# Altium schematic sheet 1_V5.schdoc
size 175 x 99 mm
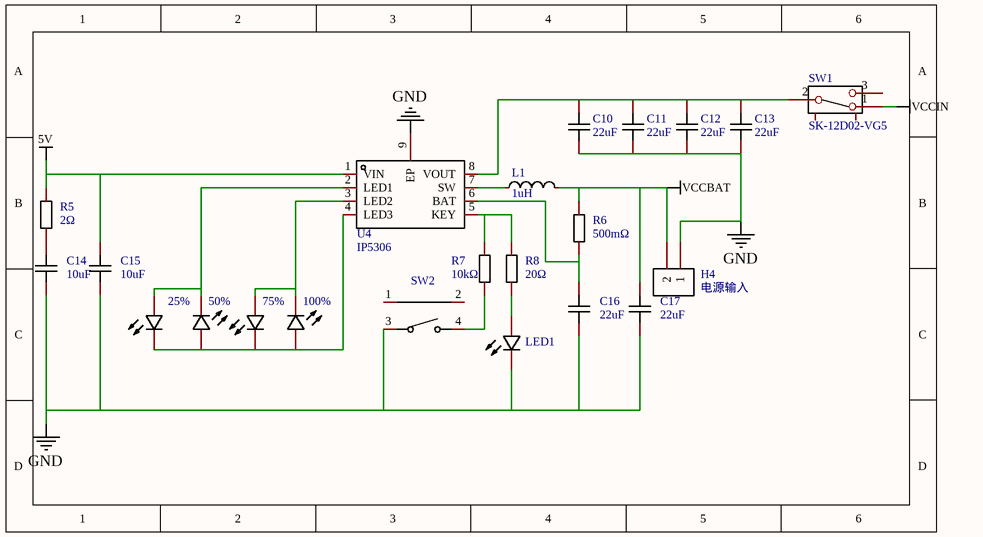
[diagram p0: 1_V5.schdoc]

## Parts
25%  19-217/GHC-YR1S2/3T  [LED0603-RD]  (value not drawn)
50%  19-217/GHC-YR1S2/3T  [LED0603-RD]  (value not drawn)
75%  19-217/GHC-YR1S2/3T  [LED0603-RD]  (value not drawn)
100%  19-217/GHC-YR1S2/3T  [LED0603-RD]  (value not drawn)
C10  22uF  [C1206]
C11  22uF  [C1206]
C12  22uF  [C1206]
C13  22uF  [C1206]
C14  10uF  [C0805]
C15  10uF  [C0805]
C16  22uF  [C1206]
C17  22uF  [C1206]
H4  电源输入  [HDR-TH_2P-P2.54-V-M-1]
L1  1uH  [IND-SMD_L7.0-W6.6]
LED1  19-217/GHC-YR1S2/3T  [LED0603-RD]  (value not drawn)
R5  2Ω  [R0805]
R6  500mΩ  [R1206]
R7  10kΩ  [R0603]
R8  20Ω  [R0603]
SW1  SK-12D02-VG5  [SW-TH_SK-12D02-VG5]
SW2  TS24CA  [SW-SMD_TS24CA]  (value not drawn)
U4  IP5306  [ESOP-8_L4.9-W3.9-P1.27-LS6.0-BL-EP]

## Nets
5V: C15.2 R5.2 U4.1(VIN)
GND: C10.1 C11.1 C12.1 C13.1 C14.1 C15.1 C16.1 C17.1 H4.1 LED1.1(C) SW2.3 U4.9(EP)
VCCBAT: C17.2 H4.2 L1.2 R6.2
VCCIN: SW1.1
Net25%_1: 25%.1(C) 50%.2(A) 75%.1(C) 100%.2(A) U4.4(LED3)
Net25%_2: 25%.2(A) 50%.1(C) U4.2(LED1)
Net75%_2: 75%.2(A) 100%.1(C) U4.3(LED2)
NetC10_2: C10.2 C11.2 C12.2 C13.2 SW1.2 U4.8(VOUT)
NetC14_2: C14.2 R5.1
NetC16_2: C16.2 R6.1 U4.6(BAT)
NetL1_1: L1.1 U4.7(SW)
NetLED1_2: LED1.2(A) R8.1
NetR7_1: R7.1 SW2.4
NetR7_2: R7.2 R8.2 U4.5(KEY)

Not connected (* = marked no-connect by the designer): SW1 3 4 5; SW2 1 2

## Library data of the parts
25% 50% 75% 100% LED1 = 19-217/GHC-YR1S2/3T: 发光颜色:翠绿;二极管配置:-;主波长:520nm~535nm;色温:-;功率:110mW;安装方式:-;; Manufacturer: EVERLIGHT(亿光); Add into BOM: yes; Emitted Color: 翠绿; Lens Color: 无色透明; Peak Wavelength: 518nm; Forward Current: 20mA; Power Dissipation: 110mW; Viewing Angle: 120°; Name: 19-217/GHC-YR1S2/3T; Symbol: 19-217/GHC-YR1S2/3T; Device: 19-217/GHC-YR1S2/3T; LCSC Part Name: 19-217/GHC-YR1S2/3T; Supplier Part: C72043; Manufacturer Part: 19-217/GHC-YR1S2/3T; Supplier Footprint: 0603; JLCPCB Part Class: Basic Part; Datasheet: https://atta.szlcsc.com/upload/public/pdf/source/20160507/1462613613780.pdf; Supplier: LCSC; Convert to PCB: yes; Diode Configuration: -; Dominant Wavelength: 520nm~535nm; Color Temperature: -; Mounting Sytle: -; Operating Temperature: -40℃~+85℃
C10-C13 C16 C17 = C3216X5R1V226MTJ00E: 容值:22uF;精度:±20%;额定电压:35V;材质(温度系数):X5R;; Manufacturer: TDK; Add into BOM: yes; Tolerance: ±20%; Voltage Rated: 35V; Temperature Coefficient: X5R; NAME: 2; Pin Type: IN; Name: 22uF; Symbol: C3216X5R1V226MTJ00E; Device: C3216X5R1V226MTJ00E; LCSC Part Name: 22uF ±20% 35V; Supplier Part: C342620; Manufacturer Part: C3216X5R1V226MTJ00E; Supplier Footprint: 1206; JLCPCB Part Class: Extended Part; Datasheet: https://atta.szlcsc.com/upload/public/pdf/source/20190225/C342620_AEDAF1591EBCA53DD875EA2BBF91AE9A.pdf; Supplier: LCSC; Convert to PCB: yes; Value: 22uF; NUMBER: 2
C14 C15 = GRM21BR61H106KE43L: 容值:10uF;精度:±10%;额定电压:50V;材质(温度系数):X5R;; Manufacturer: muRata(村田); Add into BOM: yes; Tolerance: ±10%; Voltage Rated: 50V; Temperature Coefficient: X5R; Name: 10uF; Symbol: GRM21BR61H106KE43L; Device: GRM21BR61H106KE43L; LCSC Part Name: 10uF ±10% 50V; Supplier Part: C440198; Manufacturer Part: GRM21BR61H106KE43L; Supplier Footprint: 0805; JLCPCB Part Class: Basic Part; Datasheet: https://atta.szlcsc.com/upload/public/pdf/source/20191220/C440198_2DEA1B9834E321C8893F7972E9DFE5B0.pdf; Supplier: LCSC; Convert to PCB: yes; Value: 10uF
H4 = 电源端口: Manufacturer: TE Connectivity(美国泰科); Manufacturer Part: 3-644456-2; 3DModel: HDR-M-2.54_1x2; Add into BOM: yes; Name: 电源输入; Symbol: 电源端口; Device: 电源端口; link: https://item.szlcsc.com/366904.html; Supplier: LCSC; Supplier Part: C90288; JLCPCB Part Class: Extended Part; Convert to PCB: yes; Origin Footprint: HDR-TH_2P-P2.54-V-M-1
L1 = FXL0618-1R0-M: 电感值:1uH;精度:±20%;额定电流:8.5A;饱和电流(Isat):14A;; Manufacturer: cjiang(长江微电); Add into BOM: yes; Tolerance: ±20%; Rated Current: 8.5A; Saturation Current (Isat): 14A; DC Resistance (DCR): 13mΩ; Name: 1uH; Symbol: FXL0618-1R0-M; Device: FXL0618-1R0-M; LCSC Part Name: 1uH ±20% 8.5A 13mΩ; Supplier Part: C524591; Manufacturer Part: FXL0618-1R0-M; Supplier Footprint: SMD,6.6x7mm; JLCPCB Part Class: Extended Part; Datasheet: https://atta.szlcsc.com/upload/public/pdf/source/20200117/C485363_A2440626DC7482D75DD0DD56D1883FBF.pdf; Supplier: LCSC; Convert to PCB: yes; Value: 1uH
R5 = 0805W8F200KT5E: 电阻类型:厚膜电阻;阻值:2Ω;精度:±1%;功率:125mW;; Manufacturer: UNI-ROYAL(厚声); Add into BOM: yes; Tolerance: ±1%; Power(Watts): 125mW; Temperature Coefficient: ±400ppm/℃; Overload Voltage (Max): 150V; Name: 2Ω; Symbol: 0805W8F200KT5E; Device: 0805W8F200KT5E; LCSC Part Name: 2Ω ±1% 125mW; Supplier Part: C17606; Manufacturer Part: 0805W8F200KT5E; Supplier Footprint: 0805; JLCPCB Part Class: Basic Part; Datasheet: https://atta.szlcsc.com/upload/public/pdf/source/20200306/C422600_1E6D84923E4A46A82E41ADD87F860B5C.pdf; Supplier: LCSC; Convert to PCB: yes; Type: 厚膜电阻; Value: 2Ω; Operating Temperature Range: -55℃~+155℃
R6 = 1206W4F500LT5E: 电阻类型:厚膜电阻;阻值:500mΩ;精度:±1%;功率:250mW;; Manufacturer: UNI-ROYAL(厚声); Add into BOM: yes; Tolerance: ±1%; Power(Watts): 250mW; Temperature Coefficient: ±800ppm/℃; Overload Voltage (Max): 200V; Name: 500mΩ; Symbol: 1206W4F500LT5E; Device: 1206W4F500LT5E; LCSC Part Name: 500mΩ ±1% 250mW; Supplier Part: C25340; Manufacturer Part: 1206W4F500LT5E; Supplier Footprint: 1206; JLCPCB Part Class: Extended Part; Datasheet: https://atta.szlcsc.com/upload/public/pdf/source/20200306/C422600_1E6D84923E4A46A82E41ADD87F860B5C.pdf; Supplier: LCSC; Convert to PCB: yes; Type: 厚膜电阻; Value: 500mΩ; Operating Temperature Range: -55℃~+155℃
R7 = 0603WAF1002T5E: 电阻类型:厚膜电阻;阻值:10kΩ;精度:±1%;功率:100mW;; Manufacturer: UNI-ROYAL(厚声); Add into BOM: yes; Tolerance: ±1%; Power(Watts): 100mW; Temperature Coefficient: ±100ppm/℃; Overload Voltage (Max): 75V; Name: 10kΩ; Symbol: 0603WAF1002T5E; Device: 0603WAF1002T5E; LCSC Part Name: 厚膜电阻 10kΩ ±1% 100mW; Supplier Part: C25804; Manufacturer Part: 0603WAF1002T5E; Supplier Footprint: 0603; JLCPCB Part Class: Basic Part; Datasheet: https://atta.szlcsc.com/upload/public/pdf/source/20200306/C422600_1E6D84923E4A46A82E41ADD87F860B5C.pdf; Supplier: LCSC; Convert to PCB: yes; Type: 厚膜电阻; Value: 10kΩ; Operating Temperature Range: -55℃~+155℃
R8 = 0603WAF200JT5E: 电阻类型:厚膜电阻;阻值:20Ω;精度:±1%;功率:100mW;; Manufacturer: UNI-ROYAL(厚声); Add into BOM: yes; Tolerance: ±1%; Power(Watts): 100mW; Temperature Coefficient: ±100ppm/℃; Overload Voltage (Max): 75V; NAME: 1; Pin Type: IN; Name: 20Ω; Symbol: 0603WAF200JT5E; Device: 0603WAF200JT5E; LCSC Part Name: 20Ω ±1% 100mW; Supplier Part: C22950; Manufacturer Part: 0603WAF200JT5E; Supplier Footprint: 0603; JLCPCB Part Class: Basic Part; Datasheet: https://atta.szlcsc.com/upload/public/pdf/source/20200306/C422600_1E6D84923E4A46A82E41ADD87F860B5C.pdf; Supplier: LCSC; Convert to PCB: yes; Type: 厚膜电阻; Value: 20Ω; Operating Temperature Range: -55℃~+155℃; NUMBER: 1
SW1 = SK-12D02-VG5_C136722: 额定电流(DC):-;额定电压(DC):-;额定电流(AC):-;额定电压(AC):-;电路结构:单刀双掷;安装方式:卧插;机械寿命:5000;滑钮形状:矩形柱状;引脚样式:PC引脚;工作温度:-25℃~+70℃;开关高度:9.5mm;; Manufacturer: 韩国韩荣; Add into BOM: yes; Circuit: 单刀双掷; Mechanical Life: 5000; Actuator Style: 矩形柱状; Pin Style: PC引脚; Switch Height: 9.5mm; Name: SK-12D02-VG5; Symbol: SK-12D02-VG5; Device: SK-12D02-VG5_C136722; LCSC Part Name: SK-12D02-VG5; Supplier Part: C136722; Manufacturer Part: SK-12D02-VG5; Supplier Footprint: 插件; JLCPCB Part Class: Extended Part; Datasheet: https://atta.szlcsc.com/upload/public/pdf/source/20180731/C136723_39114FC09BF2E9DC98823B78B7234B45.pdf; Supplier: LCSC; Convert to PCB: yes; Current Rating (DC): -; Voltage Rating (DC): -; Current Rating (AC): -; Voltage Rating (AC): -; Mounting Style: 卧插; Operating Temperature: -25℃~+70℃
SW2 = TS24CA: 触点电流:50mA;额定电压(DC):12V;电路结构:单刀单掷;安装方式:卧贴;带灯:-;机械寿命:-;; Manufacturer: SHOU HAN(首韩); Add into BOM: yes; Contact Current: 50mA; Voltage Rating (DC): 12V; Circuit: 单刀单掷; Actuator Style: 矩形按钮; Switch Length: 4.55mm; Switch Width: 1.8mm; Switch Height: 3.5mm; Name: TS24CA; Symbol: TS24CA; Device: TS24CA; LCSC Part Name: 4.55*1.8*3.5mm 卧贴 轻触开关; Supplier Part: C393942; Manufacturer Part: TS24CA; Supplier Footprint: SMD; JLCPCB Part Class: Extended Part; Datasheet: https://atta.szlcsc.com/upload/public/pdf/source/20190521/C393942_591A9E318887EFA4274D34029981AD99.pdf; Supplier: LCSC; Convert to PCB: yes; Mounting Style: 卧贴; With Lamp: -; Mechanical Life: -
U4 = IP5306: 2.1A充电2.4A放电高集成度移动电源SOC; Manufacturer: INJOINIC(英集芯); Add into BOM: yes; Name: IP5306; Symbol: IP5306; Device: IP5306; LCSC Part Name: IP5306; Supplier Part: C181692; Manufacturer Part: IP5306; Supplier Footprint: ESOP-8; JLCPCB Part Class: Extended Part; Datasheet: https://atta.szlcsc.com/upload/public/pdf/source/20180920/C181692_842C9BF636DF123BB66E91FC1AD6F13F.pdf; Supplier: LCSC; Convert to PCB: yes